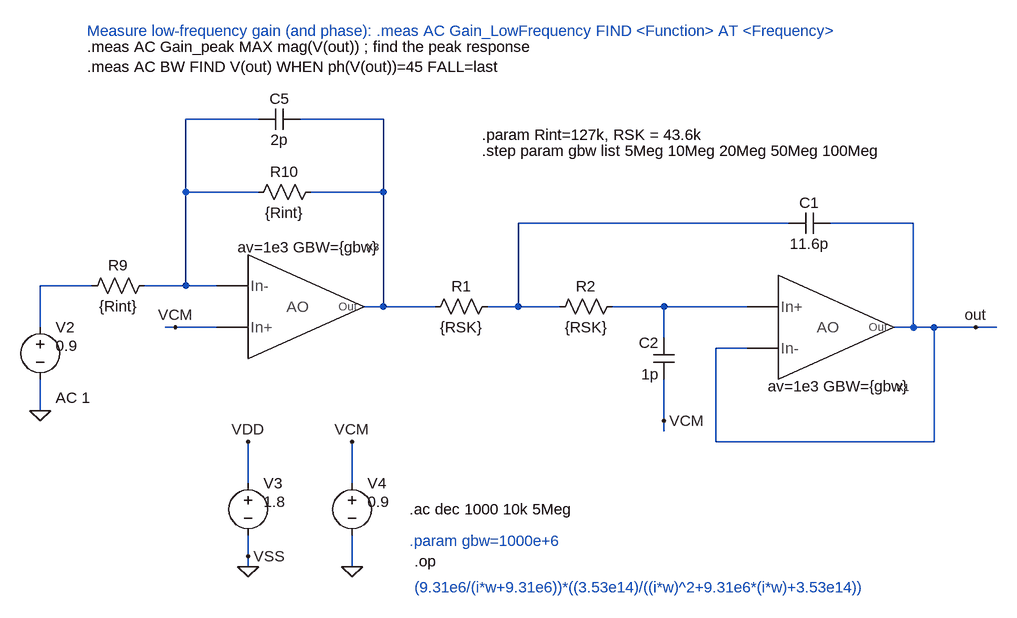
[diagram p0: schematic FTJ_ord3_SallenKey_AO_2poles.asc]
FTJ_ord3_SallenKey_AO_2poles.asc, the LTspice schematic file:
Version 4
SHEET 1 2712 1708
WIRE 1440 -144 1328 -144
WIRE 1632 -144 1504 -144
WIRE 1328 -32 1328 -144
WIRE 1440 -32 1328 -32
WIRE 1632 -32 1632 -144
WIRE 1632 -32 1520 -32
WIRE 2256 16 1840 16
WIRE 2448 16 2320 16
WIRE 1184 112 1104 112
WIRE 1328 112 1328 -32
WIRE 1328 112 1264 112
WIRE 1376 112 1328 112
WIRE 1632 144 1632 -32
WIRE 1632 144 1600 144
WIRE 1712 144 1632 144
WIRE 1840 144 1840 16
WIRE 1840 144 1792 144
WIRE 1904 144 1840 144
WIRE 2064 144 1984 144
WIRE 2192 144 2064 144
WIRE 1104 176 1104 112
WIRE 1312 176 1296 176
WIRE 1376 176 1312 176
WIRE 2448 176 2448 16
WIRE 2448 176 2416 176
WIRE 2480 176 2448 176
WIRE 2544 176 2480 176
WIRE 2576 176 2544 176
WIRE 2064 192 2064 144
WIRE 2192 208 2144 208
WIRE 1104 304 1104 256
WIRE 2064 320 2064 256
WIRE 2064 336 2064 320
WIRE 2144 352 2144 208
WIRE 2480 352 2480 176
WIRE 2480 352 2144 352
WIRE 1424 416 1424 352
WIRE 1584 416 1584 352
WIRE 1424 528 1424 496
WIRE 1424 544 1424 528
WIRE 1584 544 1584 496
FLAG 1104 304 0
FLAG 2544 176 out
FLAG 1424 544 0
FLAG 1584 544 0
FLAG 1424 352 VDD
FLAG 1584 352 VCM
FLAG 1424 528 VSS
FLAG 1312 176 VCM
FLAG 2064 320 VCM
DATAFLAG 1136 112 ""
DATAFLAG 1632 -96 ""
SYMBOL cap 2320 0 R90
WINDOW 0 0 32 VBottom 2
WINDOW 3 32 32 VTop 2
SYMATTR InstName C1
SYMATTR Value 11.6p
SYMBOL voltage 1104 160 R0
WINDOW 123 24 124 Left 2
WINDOW 39 0 0 Left 2
WINDOW 3 24 44 Left 2
SYMATTR Value2 AC 1
SYMATTR Value 0.9
SYMATTR InstName V2
SYMBOL voltage 1424 400 R0
WINDOW 123 24 124 Left 2
WINDOW 39 0 0 Left 2
WINDOW 3 24 44 Left 2
SYMATTR Value 1.8
SYMATTR InstName V3
SYMBOL voltage 1584 400 R0
WINDOW 123 24 124 Left 2
WINDOW 39 0 0 Left 2
WINDOW 3 24 44 Left 2
SYMATTR Value 0.9
SYMATTR InstName V4
SYMBOL res 1808 128 R90
WINDOW 0 0 56 VBottom 2
WINDOW 3 32 56 VTop 2
SYMATTR InstName R1
SYMATTR Value {RSK}
SYMBOL res 1280 96 R90
WINDOW 0 0 56 VBottom 2
WINDOW 3 32 56 VTop 2
SYMATTR InstName R9
SYMATTR Value {Rint}
SYMBOL cap 1504 -160 R90
WINDOW 0 0 32 VBottom 2
WINDOW 3 32 32 VTop 2
SYMATTR InstName C5
SYMATTR Value 2p
SYMBOL res 1536 -48 R90
WINDOW 0 0 56 VBottom 2
WINDOW 3 32 56 VTop 2
SYMATTR InstName R10
SYMATTR Value {Rint}
SYMBOL res 2000 128 R90
WINDOW 0 0 56 VBottom 2
WINDOW 3 32 56 VTop 2
SYMATTR InstName R2
SYMATTR Value {RSK}
SYMBOL cap 2080 256 R180
WINDOW 0 24 56 Left 2
WINDOW 3 24 8 Left 2
SYMATTR InstName C2
SYMATTR Value 1p
SYMBOL AO_2poles 1424 144 R0
WINDOW 39 -16 -91 Left 2
SYMATTR SpiceLine av=1e3 GBW={gbw}
SYMATTR InstName X3
SYMBOL AO_2poles 2240 176 M180
WINDOW 39 -16 -91 Left 2
SYMATTR SpiceLine av=1e3 GBW={gbw}
SYMATTR InstName X1
TEXT 1672 456 Left 2 !.ac dec 1000 10k 5Meg
TEXT 1672 504 Left 2 ;.param gbw=1000e+6
TEXT 1680 536 Left 2 !.op
TEXT 1680 576 Left 2 ;(9.31e6/(i*w+9.31e6))*((3.53e14)/((i*w)^2+9.31e6*(i*w)+3.53e14))
TEXT 1784 -120 Left 2 !.param Rint=127k, RSK = 43.6k
TEXT 1176 -280 Left 2 ;Measure low-frequency gain (and phase): .meas AC Gain_LowFrequency FIND <Function> AT <Frequency>
TEXT 1176 -256 Left 2 !.meas AC Gain_peak MAX mag(V(out)) ; find the peak response\n.meas AC BW FIND V(out) WHEN ph(V(out))=45 FALL=last
TEXT 1784 -96 Left 2 !.step param gbw list 5Meg 10Meg 20Meg 50Meg 100Meg

The netlist it stands for:
* FTJ_ord3_SallenKey_AO_2poles.asc
C1 out N003 11.6p
V2 N004 0 0.9 AC 1
V3 VDD 0 1.8
V4 VCM 0 0.9
R1 N003 N002 {RSK}
R9 N001 N004 {Rint}
C5 N002 N001 2p
R10 N002 N001 {Rint}
R2 N005 N003 {RSK}
C2 VCM N005 1p
XX3 N001 N002 VCM AO_2poles params: av=1e3 GBW={gbw}  ; pins In- Out In+
XX1 out out N005 AO_2poles params: av=1e3 GBW={gbw}  ; pins In- Out In+
.ac dec 1000 10k 5Meg
* .param gbw=1000e+6
.op
* (9.31e6/(i*w+9.31e6))*((3.53e14)/((i*w)^2+9.31e6*(i*w)+3.53e14))
.param Rint=127k, RSK = 43.6k
* Measure low-frequency gain (and phase): .meas AC Gain_LowFrequency FIND <Function> AT <Frequency>
.meas AC Gain_peak MAX mag(V(out)) ; find the peak response
.meas AC BW FIND V(out) WHEN ph(V(out))=45 FALL=last
.step param gbw list 5Meg 10Meg 20Meg 50Meg 100Meg
.backanno
.end